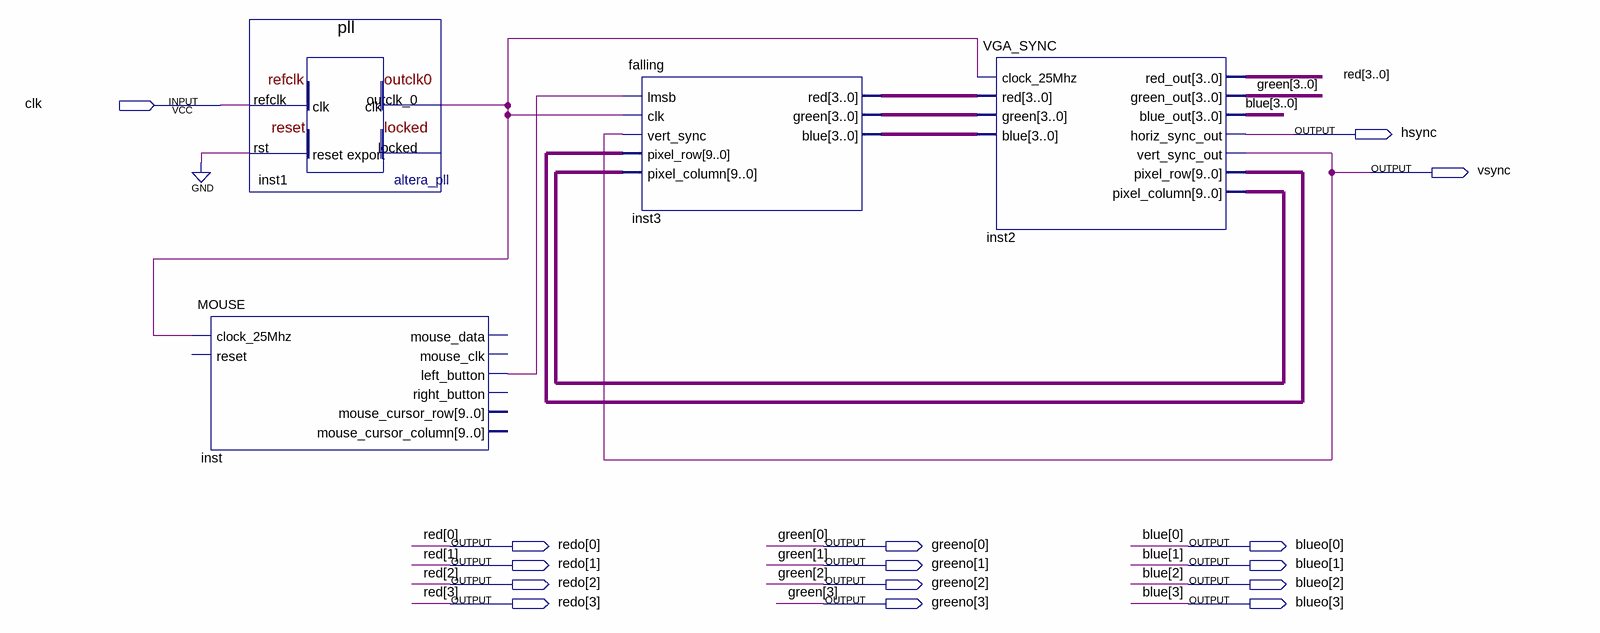
[diagram p0: schematic sheet]
// Quartus schematic Schematic.bdf as structural Verilog: 4 symbols, 15 pins
module Schematic (
  input  clk,
  output hsync,
  output vsync,
  output [3:0] redo,
  output [3:0] greeno,
  output [3:0] blueo
);

  wire inst1_outclk_0, inst_left_button;
  wire [3:0] inst3_blue, inst3_green, inst3_red;
  wire [9:0] inst2_pixel_column, inst2_pixel_row;

  MOUSE inst (
    .clock_25Mhz(inst1_outclk_0), .left_button(inst_left_button));  // open: reset, right_button, mouse_cursor_row, mouse_cursor_column, mouse_data, mouse_clk
  pll inst1 (.refclk(clk), .rst(1'b0), .outclk_0(inst1_outclk_0));  // open: locked
  falling inst3 (
    .lmsb(inst_left_button), .clk(inst1_outclk_0), .vert_sync(vsync), .pixel_row(inst2_pixel_row),
    .pixel_column(inst2_pixel_column), .red(inst3_red), .green(inst3_green), .blue(inst3_blue));
  VGA_SYNC inst2 (
    .clock_25Mhz(inst1_outclk_0), .red(inst3_red), .green(inst3_green), .blue(inst3_blue), .red_out(redo),
    .green_out(greeno), .blue_out(blueo), .horiz_sync_out(hsync), .vert_sync_out(vsync),
    .pixel_row(inst2_pixel_row), .pixel_column(inst2_pixel_column));

  // Other names for the same wires on the sheet: blue[3:0] = blueo; green[3:0] = greeno; red[3:0] = redo
endmodule
